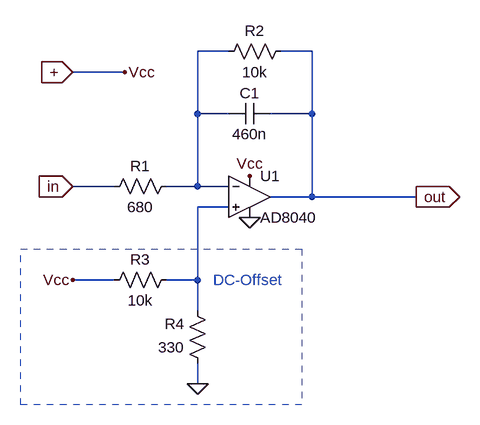
[diagram p0: schematic triangular-wave_generator.asc]
triangular-wave_generator.asc, the LTspice schematic file:
Version 4
SHEET 1 880 692
WIRE -128 16 -176 16
WIRE 0 16 -48 16
WIRE -288 48 -368 48
WIRE -176 112 -176 16
WIRE -128 112 -176 112
WIRE 0 112 0 16
WIRE 0 112 -64 112
WIRE -304 224 -368 224
WIRE -176 224 -176 112
WIRE -176 224 -224 224
WIRE -128 224 -176 224
WIRE 0 240 0 112
WIRE 0 240 -64 240
WIRE 160 240 0 240
WIRE -128 256 -176 256
WIRE -304 368 -368 368
WIRE -176 368 -176 256
WIRE -176 368 -224 368
WIRE -176 416 -176 368
WIRE -176 528 -176 496
FLAG -96 208 Vcc
FLAG -368 224 in
IOPIN -368 224 In
FLAG -96 272 0
FLAG 160 240 out
IOPIN 160 240 Out
FLAG -368 368 Vcc
FLAG -176 528 0
FLAG -288 48 Vcc
FLAG -368 48 +
IOPIN -368 48 In
SYMBOL res -320 240 R270
WINDOW 0 32 56 VTop 2
WINDOW 3 0 56 VBottom 2
SYMATTR InstName R1
SYMATTR Value 680
SYMBOL cap -64 96 R90
WINDOW 0 0 32 VBottom 2
WINDOW 3 32 32 VTop 2
SYMATTR InstName C1
SYMATTR Value 460n
SYMBOL res -32 0 R90
WINDOW 0 0 56 VBottom 2
WINDOW 3 32 56 VTop 2
SYMATTR InstName R2
SYMATTR Value 10k
SYMBOL Opamps\\AD8040 -96 176 R0
SYMATTR InstName U1
SYMBOL res -208 352 R90
WINDOW 0 0 56 VBottom 2
WINDOW 3 32 56 VTop 2
SYMATTR InstName R3
SYMATTR Value 10k
SYMBOL res -160 512 R180
WINDOW 0 36 76 Left 2
WINDOW 3 36 40 Left 2
SYMATTR InstName R4
SYMATTR Value 330
TEXT -152 368 Left 2 ;DC-Offset
RECTANGLE Normal -16 560 -448 320 2

The netlist it stands for:
* triangular-wave_generator.asc
R1 in N001 680
C1 out N001 460n
R2 out N001 10k
XU1 N002 N001 + 0 out AD8040  ; pins In+ In- V+ V- OUT
R3 N002 + 10k
R4 0 N002 330
* DC-Offset
.backanno
.end